# Altium schematic sheet budzik.SchDoc
size A3
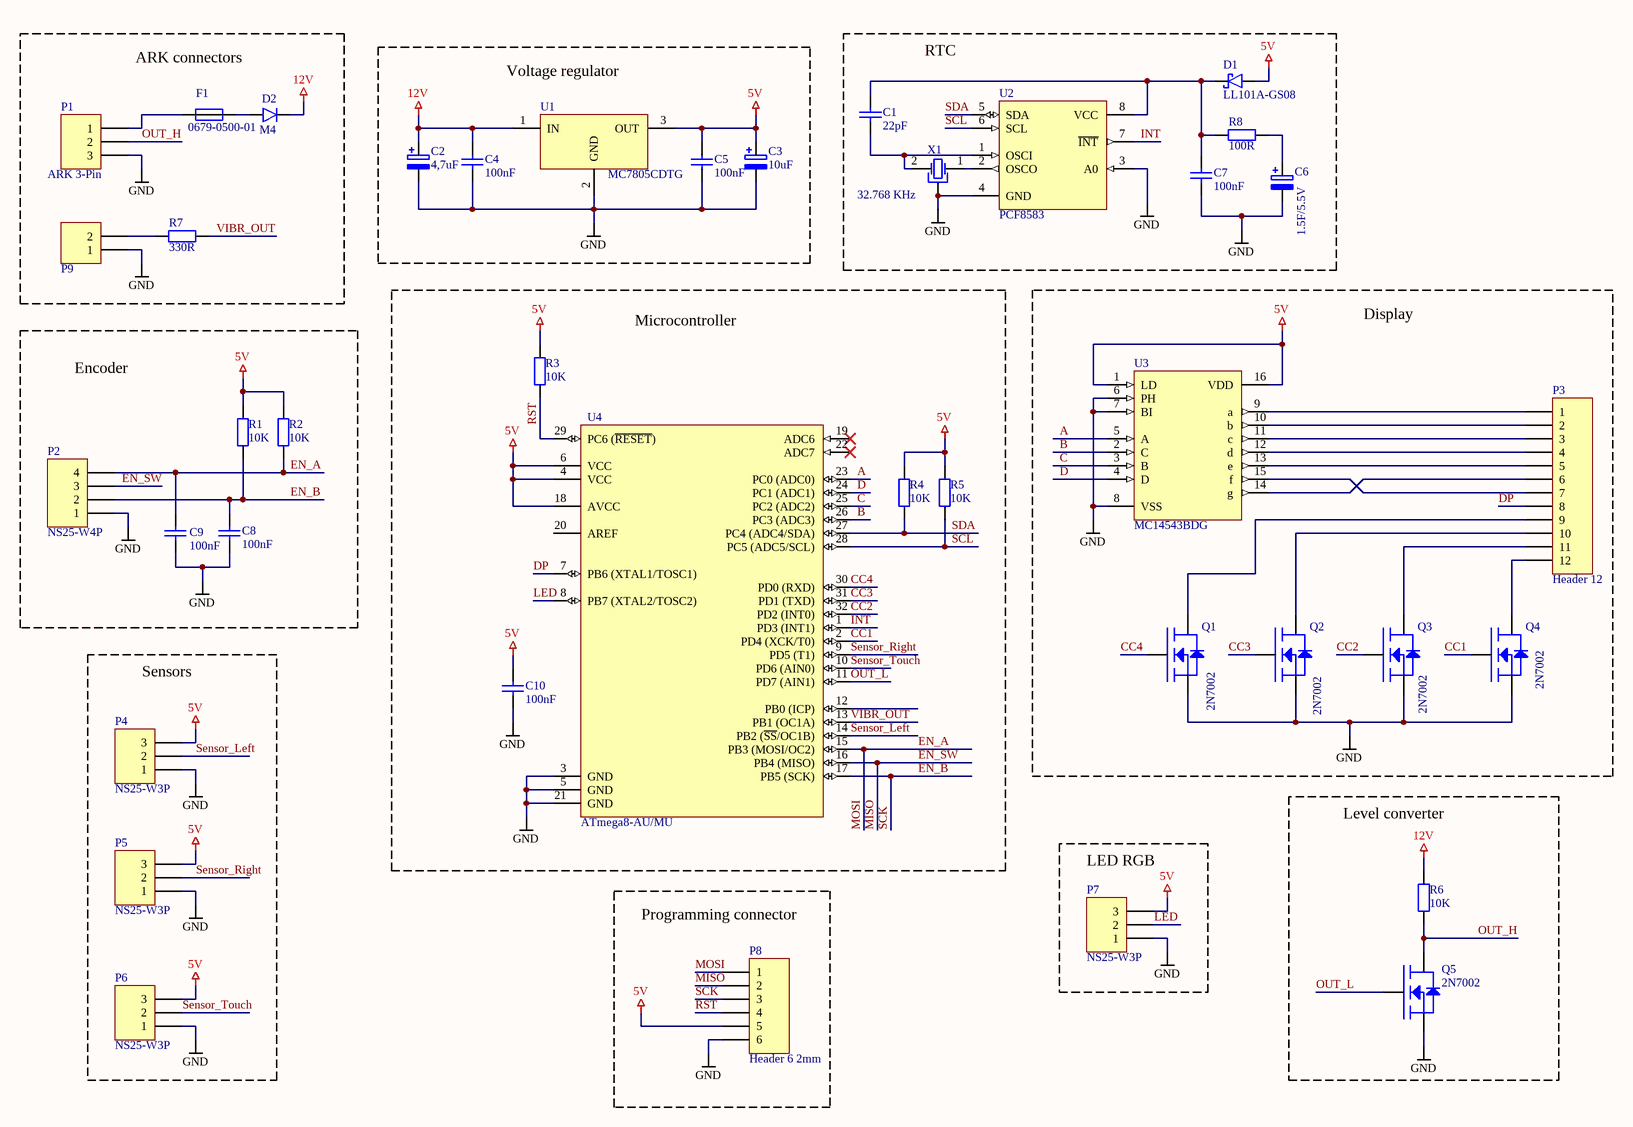
[diagram p0: budzik.SchDoc]

## Parts
C1  22pF  [C0805]
C2  4,7uF  [TANC_B]
C3  10uF  [TANC_B]
C4  100nF  [C0805]
C5  100nF  [C0805]
C6  1.5F/5.5V  [EECS5R5H155]
C7  100nF  [C0805]
C8  100nF  [C0805]
C9  100nF  [C0805]
C10  100nF  [C0805]
D1  LL101A-GS08  [SOD80C]
D2  M4  [SMA]
F1  0679-0500-01  [0679-0500-01]
P1  ARK 3-Pin  [ARK-3.5mm-3pin]
P2  NS25-W4P  [NS25-W4P]
P3  Header 12  [MA12-1L]
P4  NS25-W3P  [NS25-W3P]
P5  NS25-W3P  [NS25-W3P]
P6  NS25-W3P  [NS25-W3P]
P7  NS25-W3P  [NS25-W3P]
P8  Header 6 2mm  [MA06-1_2mm]
P9  ARK 2-Pin  [ARK-3.5mm-2pin]  (value not drawn)
Q1  2N7002  [SOT23]
Q2  2N7002  [SOT23]
Q3  2N7002  [SOT23]
Q4  2N7002  [SOT23]
Q5  2N7002  [SOT23]
R1  10K  [R0805]
R2  10K  [R0805]
R3  10K  [R0805]
R4  10K  [R0805]
R5  10K  [R0805]
R6  10K  [R0805]
R7  330R  [R0805]
R8  100R  [R0805]
U1  MC7805CDTG  [TO-252]
U2  PCF8583  [SO-8T]
U3  MC14543BDG  [SO-16]
U4  ATmega8-AU/MU  [TQFP-32A]
X1  32.768 KHz  [TC26_V]

## Blocks framed on the sheet
ARK connectors: D2 F1 P1 P9 R7
Voltage regulator: C2-C5 U1
RTC: C1 C6 C7 D1 R8 U2 X1
Microcontroller: C10 R3-R5 U4
Display: P3 Q1-Q4 U3
Encoder: C8 C9 P2 R1 R2
Sensors: P4-P6
Level converter: Q5 R6
LED RGB: P7
Programming connector: P8

## Nets
5V: C3.1 C5.1 C10.1 D1.2 P4.3 P5.3 P6.3 P7.3 P8.5 R1.2 R2.2 R3.1 R4.2 R5.2 U1.3(OUT) U3.1(LD) U3.16(VDD) U4.4(VCC) U4.6(VCC) U4.18(AVCC)
12V: C2.1 C4.1 D2.1 R6.2 U1.1(IN)
GND: C2.2 C3.2 C4.2 C5.2 C6.2 C7.2 C8.2 C9.2 C10.2 P1.3 P2.1 P4.1 P5.1 P6.1 P7.1 P8.6 P9.1 Q1.2(S) Q2.2(S) Q3.2(S) Q4.2(S) Q5.2(S) U1.2(GND) U2.3(A0) U2.4(GND) U3.6(PH) U3.7(BI) U3.8(VSS) U4.3(GND) U4.5(GND) U4.21(GND) X1.3
A: U3.5(A) U4.23(PC0_(ADC0))
B: U3.2(C) U4.26(PC3_(ADC3))
C: U3.3(B) U4.25(PC2_(ADC2))
CC1: Q4.1(G) U4.2(PD4_(XCK/T0))
CC2: Q3.1(G) U4.32(PD2_(INT0))
CC3: Q2.1(G) U4.31(PD1_(TXD))
CC4: Q1.1(G) U4.30(PD0_(RXD))
D: U3.4(D) U4.24(PC1_(ADC1))
DP: P3.8 U4.7(PB6_(XTAL1/TOSC1))
EN_A: C9.1 P2.4 P8.1 R2.1 U4.15(PB3_(MOSI/OC2))  [also labelled MOSI]
EN_B: C8.1 P2.2 P8.3 R1.1 U4.17(PB5_(SCK))  [also labelled SCK]
EN_SW: P2.3 P8.2 U4.16(PB4_(MISO))  [also labelled MISO]
INT: U2.7(~{INT}) U4.1(PD3_(INT1))
LED: P7.2 U4.8(PB7_(XTAL2/TOSC2))
OUT_H: P1.2 Q5.3(D) R6.1
OUT_L: Q5.1(G) U4.11(PD7_(AIN1))
RST: P8.4 R3.2 U4.29(PC6_(~{RESET}))
SCL: R5.1 U2.6(SCL) U4.28(PC5_(ADC5/SCL))
SDA: R4.1 U2.5(SDA) U4.27(PC4_(ADC4/SDA))
Sensor_Left: P4.2 U4.14(PB2_(~{SS}/OC1B))
Sensor_Right: P5.2 U4.9(PD5_(T1))
Sensor_Touch: P6.2 U4.10(PD6_(AIN0))
VIBR_OUT: R7.1 U4.13(PB1_(OC1A))
NetC1_1: C1.1 C7.1 D1.1 R8.1 U2.8(VCC)
NetC1_2: C1.2 U2.1(OSCI) X1.2
NetC6_1: C6.1 R8.2
NetD2_2: D2.2 F1.2
NetF1_1: F1.1 P1.1
NetP3_1: P3.1 U3.9(a)
NetP3_2: P3.2 U3.10(b)
NetP3_3: P3.3 U3.11(c)
NetP3_4: P3.4 U3.12(d)
NetP3_5: P3.5 U3.13(e)
NetP3_6: P3.6 U3.14(g)
NetP3_7: P3.7 U3.15(f)
NetP3_9: P3.9 Q1.3(D)
NetP3_10: P3.10 Q2.3(D)
NetP3_11: P3.11 Q3.3(D)
NetP3_12: P3.12 Q4.3(D)
NetP9_2: P9.2 R7.2
NetU2_2: U2.2(OSCO) X1.1

Not connected (* = marked no-connect by the designer): U4 12(PB0_(ICP)) 19(ADC6)* 20(AREF) 22(ADC7)*

## Notes on the sheet
- Title
- Size:
- Date:
- A3
- Number:
- Time:
- Revision:
- Sheet
- of
- File:

## Library data of the parts
C1 C4 C5 C7-C10 = Cap: Capacitor
C2 C3 C6 = Cap_Pol: Capacitor Polarized
D1 = Diode Shottky
D2 = Diode
F1 = 0679-0500-01: Bezpiecznik: topikowy; szybki; ceramiczny; 500mA; 125VAC; 125VDC
P3 = Header 12: Header, 12-Pin
P8 = Header 6: Header, 6-Pin
Q1-Q5 = 2N7002(GSD): N-MOSFET
R1-R8 = Res: Resistor
U1 = 78xx
U3 = MC14543BDG: BCD na 7 segmentowy
U4 = ATmega8-AU/MU: TQFP - 32pin / MLF - 32pin; DatasheetVersion: revZ, Feb-2011; PackageVersion: revC, Oct-2010; PackageReference: 32A; PackageDescription: 32-Lead, 7x7x1.0 mm Body, 0.8mm Lead Pitch, Thin Profile Plastic Quad Flat Package (TQFP); Code_JEDEC: MS-026-ABA; ComponentLink1Description: Manufacturer URL; ComponentLink1URL: http://www.atmel.com/; ComponentLink2Description: ATmega8(L); ComponentLink2URL: http://www.atmel.com/dyn/resources/prod_documents/doc2486.pdf; ComponentLink3Description: ATmega8(L) Summary; ComponentLink3URL: http://www.atmel.com/dyn/resources/prod_documents/2486S.pdf
X1 = Crystal _GND